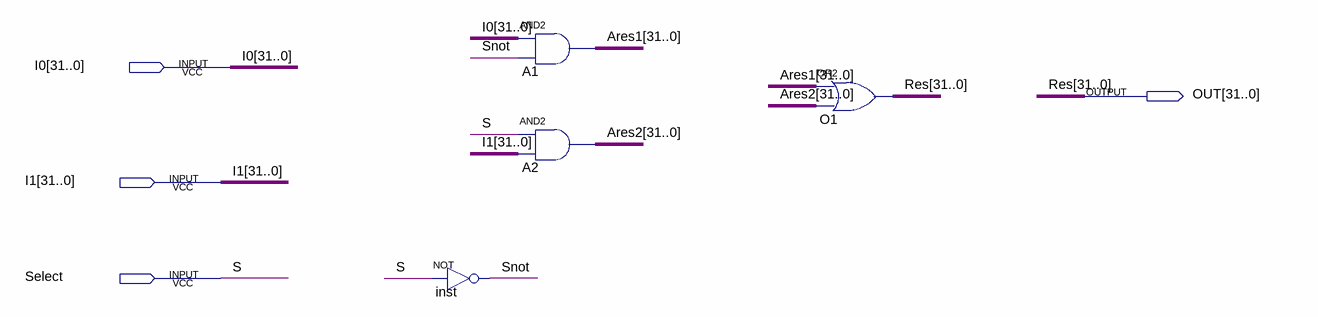
[diagram p0: schematic sheet]
// Quartus schematic mux2_1.bdf as structural Verilog: 4 symbols, 4 pins
module mux2_1 (
  input  [31:0] I0,
  input  [31:0] I1,
  input  Select,
  output [31:0] OUT
);

  wire Snot;
  wire [31:0] Ares1, Ares2;

  not inst (Snot, Select);
  assign Ares1 = I0 & {32{Snot}};  // AND2 A1, 32 bits wide
  assign Ares2 = {32{Select}} & I1;  // AND2 A2, 32 bits wide
  assign OUT = Ares1 | Ares2;  // OR2 O1, 32 bits wide

  // Other names for the same wires on the sheet: Res[31:0] = OUT; S = Select
endmodule
